# Altium schematic sheet extension_card.SchDoc
size A4; SheetNumber: 19; SheetTotal: 21
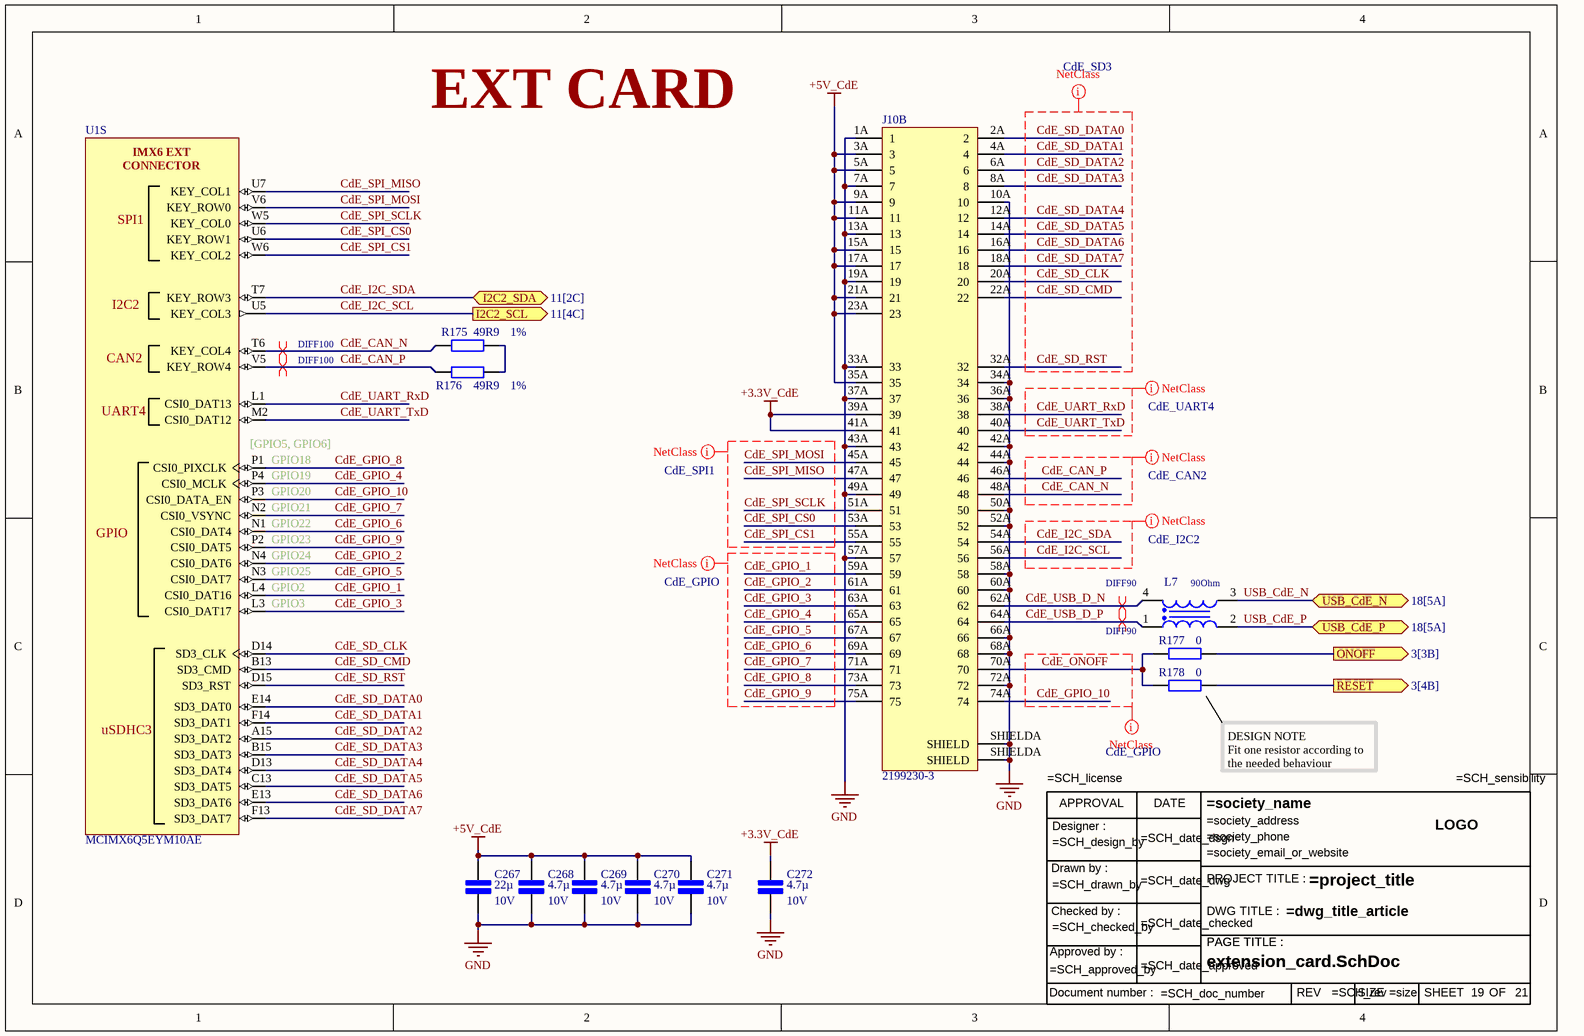
[diagram p0: extension_card.SchDoc]

## Parts
C267  22µ  Tension du diélectrique: 10V  [Cap cer 0603/4608]
C268  4.7µ  Tension du diélectrique: 10V  [Cap cer 0402/1005]
C269  4.7µ  Tension du diélectrique: 10V  [Cap cer 0402/1005]
C270  4.7µ  Tension du diélectrique: 10V  [Cap cer 0402/1005]
C271  4.7µ  Tension du diélectrique: 10V  [Cap cer 0402/1005]
C272  4.7µ  Tension du diélectrique: 10V  [Cap cer 0402/1005]
J10  2199230-3  [SATA_M2_ 2199230-3]  (part B of 2)
L7  90Ohm  [inductor coupled usb 0603]
R175  49R9  pourcentage: 1%  [Res 0402/1005]
R176  49R9  pourcentage: 1%  [Res 0402/1005]
R177  0  [Res 0603/1603]
R178  0  [Res 0603/1603]
TB18  Title bloc ANSI modified  (value not drawn)
U1  MCIMX6Q5EYM10AE  [FRES-2197-01]  (part S of 21)

## Ports
I2C2_SCL (out, see 11[4C]), I2C2_SDA (bidir, see 11[2C]), ONOFF (out, see 3[3B]), RESET (out, see 3[4B]), USB_CdE_N (bidir, see 18[5A]), USB_CdE_P (bidir, see 18[5A])

## Nets
+3.3V_CdE: C272.1 J10.39A(39) J10.41A(41)
+5V_CdE: C267.1 C268.1 C269.1 C270.1 C271.1 J10.3A(3) J10.5A(5) J10.9A(9) J10.11A(11) J10.15A(15) J10.17A(17) J10.21A(21) J10.23A(23) J10.35A(35)
GND: C267.2 C268.2 C269.2 C270.2 C271.2 C272.2 J10.1A(1) J10.7A(7) J10.10A(10) J10.13A(13) J10.19A(19) J10.33A(33) J10.34A(34) J10.36A(36) J10.37A(37) J10.42A(42) J10.43A(43) J10.44A(44) J10.49A(49) J10.50A(50) J10.52A(52) J10.57A(57) J10.58A(58) J10.60A(60) J10.66A(66) J10.68A(68) J10.72A(72) J10.SHIELDA(SHIELD)
CdE_CAN_N: J10.48A(48) R175.2 U1.T6(KEY_COL4)
CdE_CAN_P: J10.46A(46) R176.2 U1.V5(KEY_ROW4)
CdE_GPIO_1: J10.59A(59) U1.L4(CSI0_DAT16)
CdE_GPIO_2: J10.61A(61) U1.N4(CSI0_DAT6)
CdE_GPIO_3: J10.63A(63) U1.L3(CSI0_DAT17)
CdE_GPIO_4: J10.65A(65) U1.P4(CSI0_MCLK)
CdE_GPIO_5: J10.67A(67) U1.N3(CSI0_DAT7)
CdE_GPIO_6: J10.69A(69) U1.N1(CSI0_DAT4)
CdE_GPIO_7: J10.71A(71) U1.N2(CSI0_VSYNC)
CdE_GPIO_8: J10.73A(73) U1.P1(CSI0_PIXCLK)
CdE_GPIO_9: J10.75A(75) U1.P2(CSI0_DAT5)
CdE_GPIO_10: J10.74A(74) U1.P3(CSI0_DATA_EN)
CdE_I2C_SCL: J10.56A(56) U1.U5(KEY_COL3) ; port I2C2_SCL
CdE_I2C_SDA: J10.54A(54) U1.T7(KEY_ROW3) ; port I2C2_SDA
CdE_ONOFF: J10.70A(70) R177.1 R178.1
CdE_SD_CLK: J10.20A(20) U1.D14(SD3_CLK)
CdE_SD_CMD: J10.22A(22) U1.B13(SD3_CMD)
CdE_SD_DATA0: J10.2A(2) U1.E14(SD3_DAT0)
CdE_SD_DATA1: J10.4A(4) U1.F14(SD3_DAT1)
CdE_SD_DATA2: J10.6A(6) U1.A15(SD3_DAT2)
CdE_SD_DATA3: J10.8A(8) U1.B15(SD3_DAT3)
CdE_SD_DATA4: J10.12A(12) U1.D13(SD3_DAT4)
CdE_SD_DATA5: J10.14A(14) U1.C13(SD3_DAT5)
CdE_SD_DATA6: J10.16A(16) U1.E13(SD3_DAT6)
CdE_SD_DATA7: J10.18A(18) U1.F13(SD3_DAT7)
CdE_SD_RST: J10.32A(32) U1.D15(SD3_RST)
CdE_SPI_CS0: J10.53A(53) U1.U6(KEY_ROW1)
CdE_SPI_CS1: J10.55A(55) U1.W6(KEY_COL2)
CdE_SPI_MISO: J10.47A(47) U1.U7(KEY_COL1)
CdE_SPI_MOSI: J10.45A(45) U1.V6(KEY_ROW0)
CdE_SPI_SCLK: J10.51A(51) U1.W5(KEY_COL0)
CdE_UART_RxD: J10.38A(38) U1.L1(CSI0_DAT13)
CdE_UART_TxD: J10.40A(40) U1.M2(CSI0_DAT12)
CdE_USB_D_N: J10.62A(62) L7.4
CdE_USB_D_P: J10.64A(64) L7.1
ONOFF: R177.2 ; port ONOFF
RESET: R178.2 ; port RESET
USB_CdE_N: L7.3 ; port USB_CdE_N
USB_CdE_P: L7.2 ; port USB_CdE_P
NetR175_1: R175.1 R176.1

## Layout directives
net class CdE_SPI1: CdE_SPI_CS0, CdE_SPI_CS1, CdE_SPI_MISO, CdE_SPI_MOSI, CdE_SPI_SCLK
net class CdE_SD3: CdE_SD_CLK, CdE_SD_CMD, CdE_SD_DATA0, CdE_SD_DATA1, CdE_SD_DATA2, CdE_SD_DATA3, CdE_SD_DATA4, CdE_SD_DATA5, CdE_SD_DATA6, CdE_SD_DATA7, CdE_SD_RST
differential pair; differential pair class DIFF90: CdE_USB_D_N, CdE_USB_D_P
net class CdE_GPIO: CdE_GPIO_1, CdE_GPIO_2, CdE_GPIO_3, CdE_GPIO_4, CdE_GPIO_5, CdE_GPIO_6, CdE_GPIO_7, CdE_GPIO_8, CdE_GPIO_9, CdE_GPIO_10, CdE_ONOFF
net class CdE_UART4: CdE_UART_RxD, CdE_UART_TxD
net class CdE_CAN2: CdE_CAN_N, CdE_CAN_P
net class CdE_I2C2: CdE_I2C_SCL, CdE_I2C_SDA
differential pair; differential pair class DIFF100: CdE_CAN_N, CdE_CAN_P

## Notes on the sheet
- EXT CARD
- (near U1) [GPIO5, GPIO6]
- (near U1) GPIO18
- (near U1) GPIO19
- (near U1) GPIO20
- (near U1) GPIO21
- (near U1) GPIO22
- (near U1) GPIO23
- (near U1) GPIO24
- (near U1) GPIO25
- (near U1) GPIO2
- (near U1) GPIO3
- DESIGN NOTE
  Fit one resistor according to the needed behaviour
- (in symbol IMX6Q5EYM10AE, part S) IMX6 EXT CONNECTOR; SPI1; I2C2; CAN2; UART4; GPIO; uSDHC3
- (in symbol Title bloc ANSI) APPROVAL; DATE; Designer :; LOGO; Drawn by :; PROJECT TITLE :; Checked by :; DWG TITLE :; PAGE TITLE :; Approved by :; Document number :; REV; SIZE; SHEET; OF

## Library data of the parts
C267 = cap 22µ 10V: cap cer 22µ 10V 10% X5R 0603; Diélectrique: X5R
C268-C272 = cap 4.7µ 10V: cap cer 4.7µ 10V 10% X7R 0402; Diélectrique: X7R
J10 = SATA_M.2_2199230-3 / multi interface: Combined component with SATA M.2 and external card connector (M.2 format too) / ref : / 2199230-4 / 2199230-3
L7 = inductor coupled USB: WE-CNSW SMT Common Mode Line Filter, size 0603, 90Ohm, 0.55A, 50V; Manufacturer Part Number: 744230900; Manufacturer: Wurth Elektronik; DC Resistance max.: 0.145Ohm; Impedance Test Condition: 100MHz; Insulation Test Voltage: 125VAC; Winding Style: bifiliar; ComponentLink1Description: Manufacturer; ComponentLink1URL: http://www.we-online.de; ComponentLink2Description: Datasheet; ComponentLink2URL: https://www.we-online.com/catalog/datasheet/744230900.pdf; Operating Temperature: -40 to +125degC; Packaging: Tape and Reel; Published Date: April 2020; Rated Current: 0.55A; Size: 0603; Impedance: 90Ohm; Rated Voltage: 50V; Mounting Technology: SMT
R175 R176 = res 49R9 1%: res 49R9 ohm 1% 0402
R177 R178 = res 0Ohm: res 0603; pourcentage: --
TB18 = Title bloc ANSI
U1 = IMX6Q5EYM10AE: 32-Bit i.MX 6 Quad Application Processor, 1 GHz, 256 KB RAM, Extended Consumer Grade, 624-Pin FCPBGA, RoHS, Tape and Reel; PartNumber: MCIMX6Q5EYM10ACR; Manufacturer: Freescale Semiconductor; CAN: FlexCAN; Number of Cores: 4 Spec; External Memory Supported: DDR3, DDR3L, FLASH, LPDDR2; Speed Grade: 1 GHz; Core Type: ARM Cortex A9; Cache (KB): 32; Ethernet: 1 Gbps + IEEE 1588; Internal RAM (KB): 256; ComponentLink1Description: Manufacturer URL; ComponentLink2Description: Datasheet; DatasheetVersion: Rev. 2.3; ComponentLink3URL: http://cache.freescale.com/files/32bit/doc/data_sheet/IMX6DQCEC.pdf?fpsp=1&WT_TYPE=Data%20Sheets&WT_VENDOR=FREESCALE&WT_FILE_FORMAT=pdf&WT_ASSET=Documentation; ComponentLink1URL: http://www.freescale.com/; Packing: Tape and Reel; Temperature Range: -20 to 105 degC; ComponentLink2URL: http://cache.freescale.com/files/32bit/doc/data_sheet/IMX6DQCEC.pdf?fpsp=1&WT_TYPE=Data%20Sheets&WT_VENDOR=FREESCALE&WT_FILE_FORMAT=pdf&WT_ASSET=Documentation; ComponentLink3Description: Package Specification; PackageVersion: Rev. A; RoHS: TRUE; Quad/Dual CPU: i.MX 6Quad; Mounting Technology: Surface Mount; PackageReference: FCPBGA-624; PackageDescription: 624-pin Ball Grid Array Package, Body 21 x 21mm, Pitch 0.8mm